# Altium schematic sheet RTC.SchDoc
size A4; PageSetup: Record=PageOptions|CenterHorizontal=True|CenterVertical=True|PrintScale=0.99|XCorrection=1.00|YCorrection=1.00|PrintKind=1|BorderSize=5000000|LeftOffset=0|BottomOffset=0|Orientation=1|PaperLength=1000|PaperWidth=1000|Scale=100|PaperSource=15|PrintQuality=600|MediaType=1|DitherType=10|PrintScaleMode=1|PaperKind=A4|PaperIndex=9
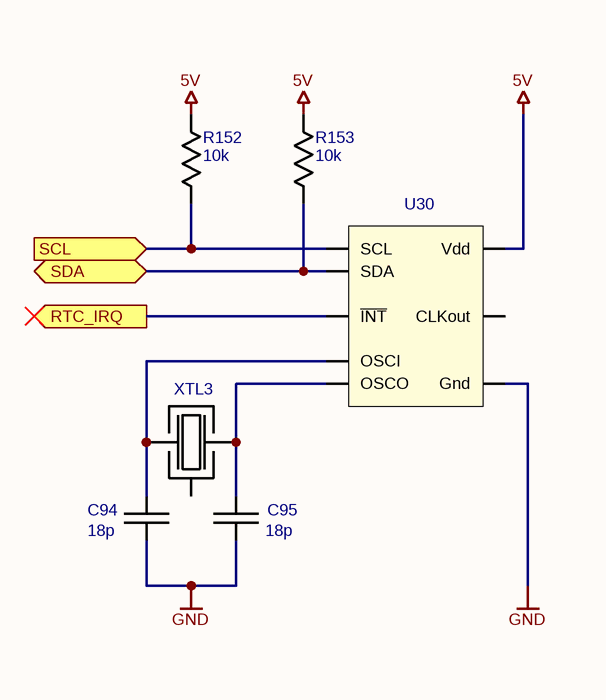
[diagram p0: RTC.SchDoc]

## Parts
C94  18p  [CAP CER 0603 NP]
C95  18p  [CAP CER 0603 NP]
R152  10k  [RES 0603]
R153  10k  [RES 0603]
U30  Real-Time Clock IC  [SOIC-8]  (value not drawn)
XTL3  32.768 kHz  [XTAL KX-327NHT]  (value not drawn)

## Ports
RTC_IRQ, SCL, SDA

## Nets
5V: R152.2 R153.2 U30.8(Vdd)
GND: C94.1 C95.1 U30.4(Gnd)
RTC_IRQ: U30.3(~{INT}) ; port RTC_IRQ
SCL: R152.1 U30.6(SCL) ; port SCL
SDA: R153.1 U30.5(SDA) ; port SDA
NetC94_2: C94.2 U30.1(OSCI) XTL3.1
NetC95_2: C95.2 U30.2(OSCO) XTL3.3

Not connected (* = marked no-connect by the designer): U30 7(CLKout); XTL3 2

## Library data of the parts
C94 C95 = Capacitor: CC0603JRNPO9BN180
R152 R153 = Resistor: RC0603FR-0710KL
U30 = PCF8653: PCF8563T/5,518
XTL3 = Quartz Resonator: 12.87150